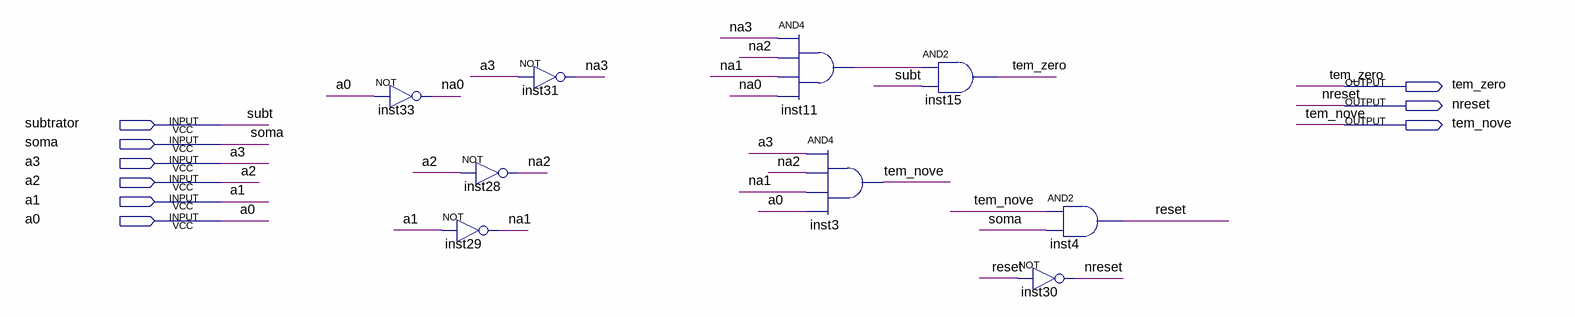
[diagram p0: schematic sheet]
// Quartus schematic tem_nove.bdf as structural Verilog: 9 symbols, 9 pins
module tem_nove (
  input  subtrator,
  input  soma,
  input  a3,
  input  a2,
  input  a1,
  input  a0,
  output tem_zero,
  output nreset,
  output tem_nove
);

  wire inst11_out, na0, na1, na2, na3, reset;

  not inst33 (na0, a0);
  not inst28 (na2, a2);
  not inst29 (na1, a1);
  not inst31 (na3, a3);
  and inst11 (inst11_out, na3, na2, na1, na0);
  and inst3 (tem_nove, a3, na2, na1, a0);
  and inst15 (tem_zero, inst11_out, subtrator);
  not inst30 (nreset, reset);
  and inst4 (reset, tem_nove, soma);

  // Other names for the same wires on the sheet: subt = subtrator
endmodule
